# Altium schematic sheet 02_Power.SchDoc
size 513 x 386 mm
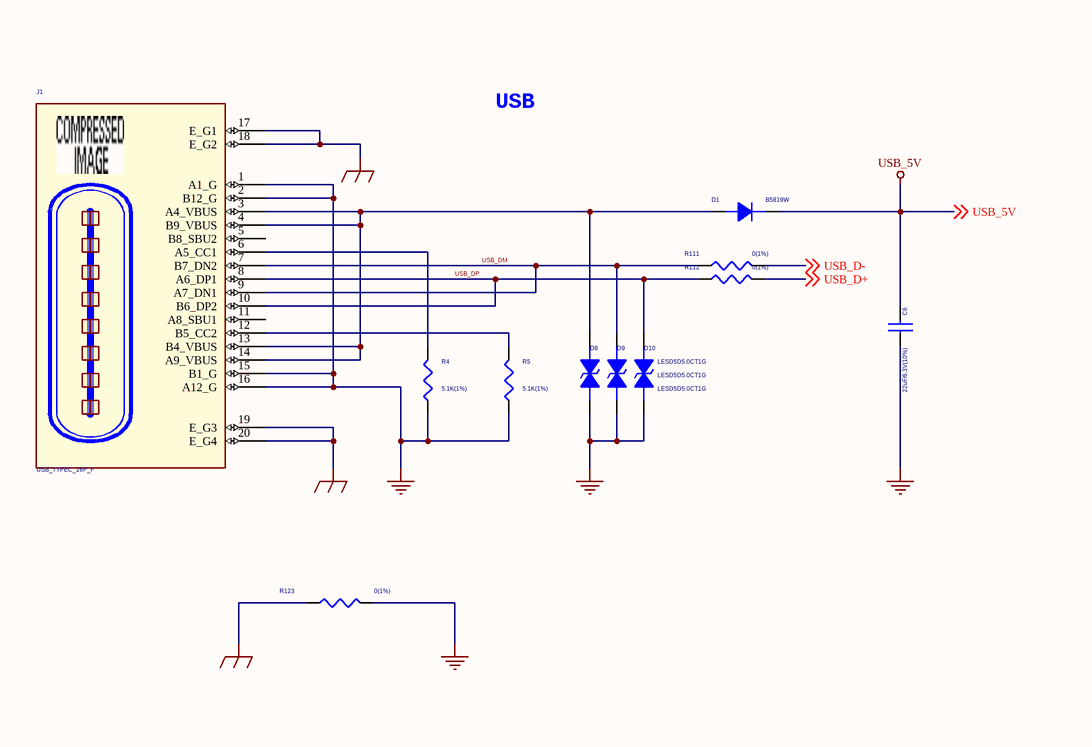
[diagram p0: 02_Power.SchDoc, left]
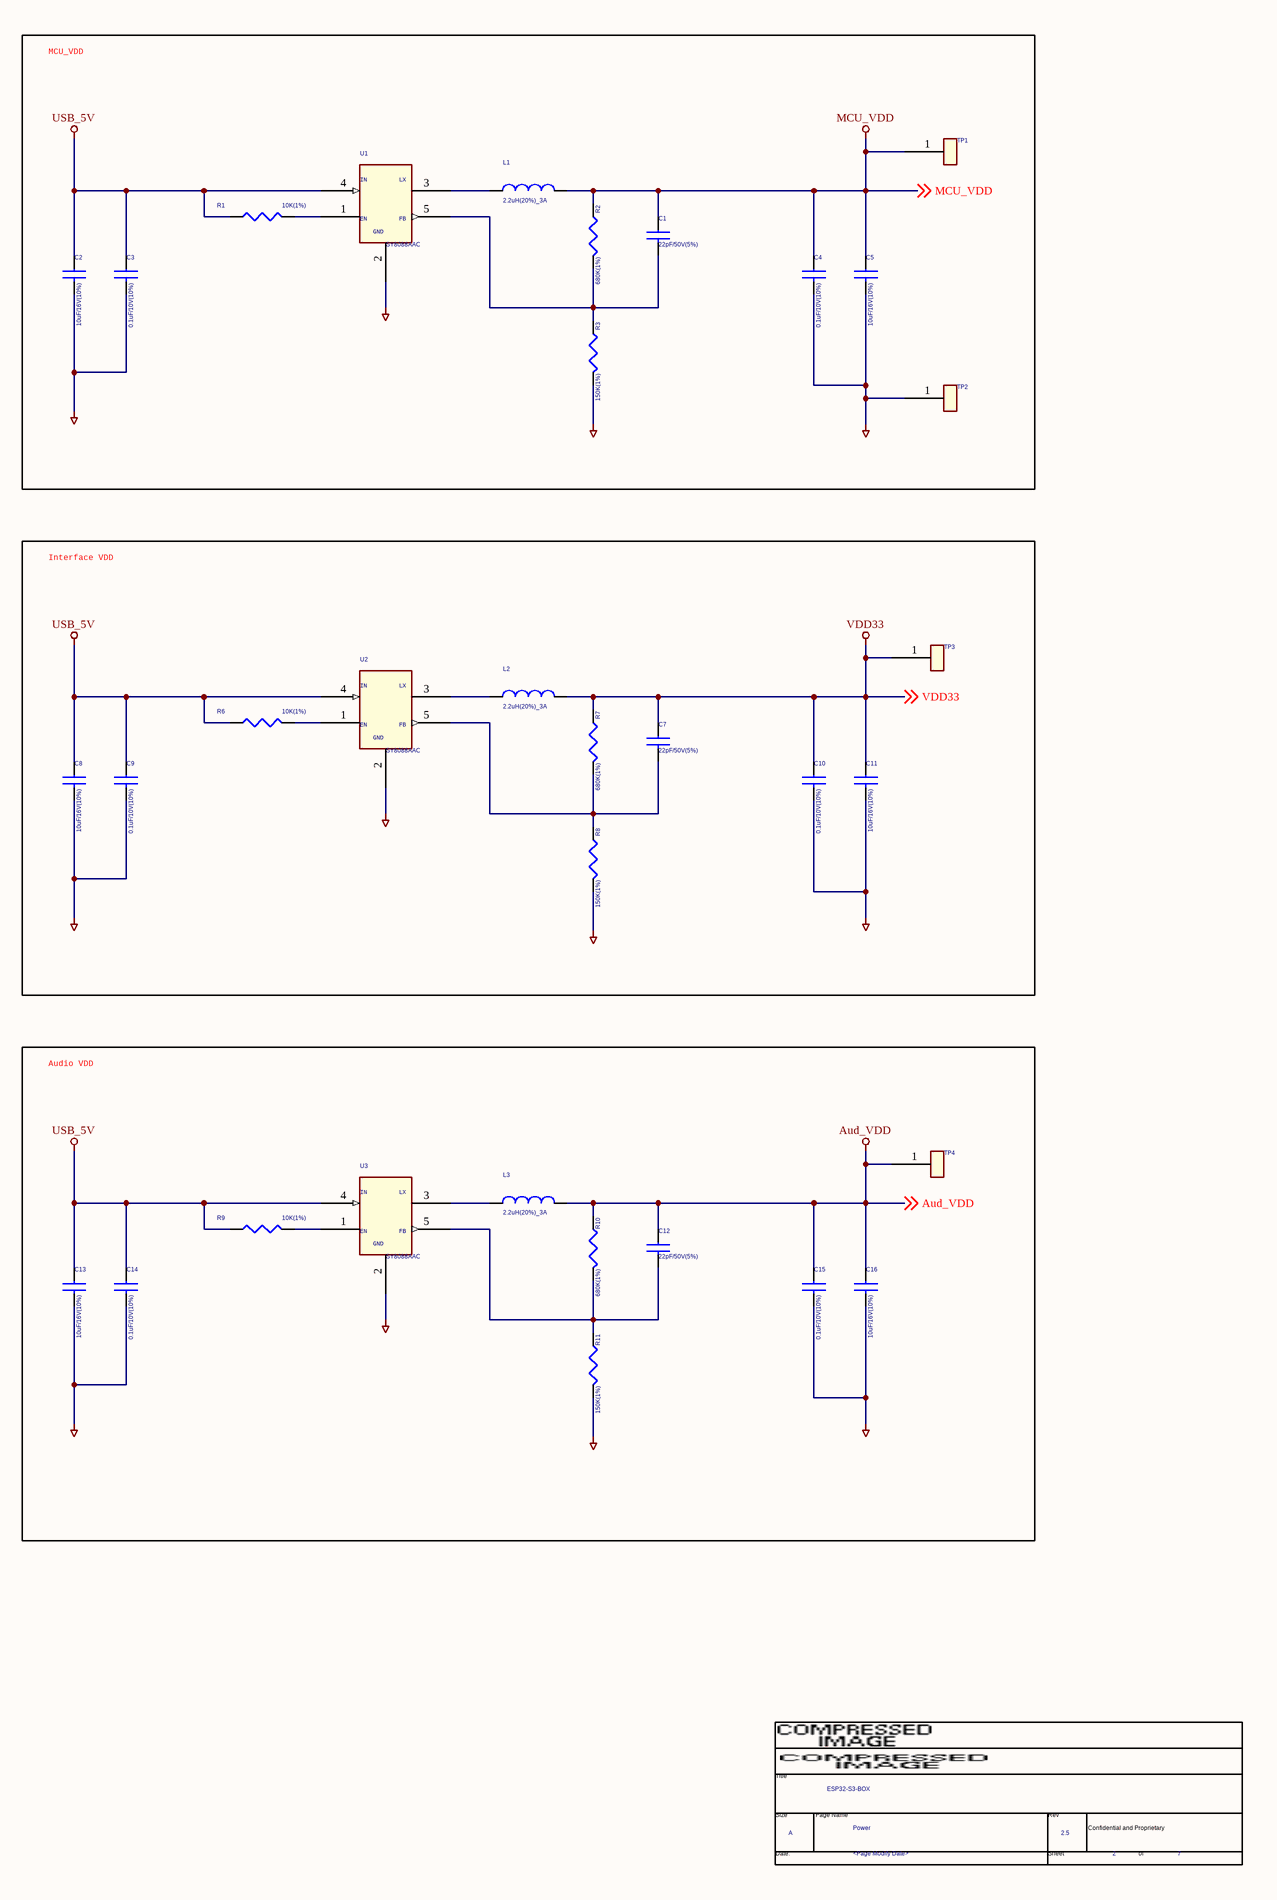
[diagram p1: 02_Power.SchDoc, right]

## Parts
*  Page Modify Date: <Page Modify Date>  Page Name: Power  Title: ESP32-S3-BOX  Page Size: A  Page Number: 2  Page Count: 7  RevCode: 2.5  (hidden comment: espTitleBlock3)  (graphical)
C1  22pF/50V(5%)  [C0402]
C2  10uF/16V(10%)  [C0603]
C3  0.1uF/10V(10%)  [C0402]
C4  0.1uF/10V(10%)  [C0402]
C5  10uF/16V(10%)  [C0603]
C6  22uF/6.3V(10%)  [C0603]
C7  22pF/50V(5%)  [C0402]
C8  10uF/16V(10%)  [C0603]
C9  0.1uF/10V(10%)  [C0402]
C10  0.1uF/10V(10%)  [C0402]
C11  10uF/16V(10%)  [C0603]
C12  22pF/50V(5%)  [C0402]
C13  10uF/16V(10%)  [C0603]
C14  0.1uF/10V(10%)  [C0402]
C15  0.1uF/10V(10%)  [C0402]
C16  10uF/16V(10%)  [C0603]
D1  B5819W  [SOD123]
D8  LESD5D5.0CT1G  [SOD523]
D9  LESD5D5.0CT1G  [SOD523]
D10  LESD5D5.0CT1G  [SOD523]
J1  USB_TYPEC_16P_F  [USB_TYPEC_16P_F]
L1  2.2uH(20%)_3A  [L4040_SL]
L2  2.2uH(20%)_3A  [L4040_SL]
L3  2.2uH(20%)_3A  [L4040_SL]
R1  10K(1%)  [R0402]
R2  680K(1%)  [R0402]
R3  150K(1%)  [R0402]
R4  5.1K(1%)  [R0201]
R5  5.1K(1%)  [R0201]
R6  10K(1%)  [R0402]
R7  680K(1%)  [R0402]
R8  150K(1%)  [R0402]
R9  10K(1%)  [R0402]
R10  680K(1%)  [R0402]
R11  150K(1%)  [R0402]
R111  0(1%)  [R0201]
R112  0(1%)  [R0201]
R123  0(1%)  [R0603]
TP1  TESTPOINT  [TPC_D40]  (value not drawn)
TP2  TESTPOINT  [TPC_D40]  (value not drawn)
TP3  TESTPOINT  [TPC_D40]  (value not drawn)
TP4  TESTPOINT  [TPC_D40]  (value not drawn)
U1  SY8088AAC  [SOT23-5]
U2  SY8088AAC  [SOT23-5]
U3  SY8088AAC  [SOT23-5]

## Blocks framed on the sheet
MCU_VDD: C1-C5 L1 R1-R3 TP1 TP2 U1
Interface VDD: C7-C11 L2 R6-R8 TP3 U2
Audio VDD: C12-C16 L3 R9-R11 TP4 U3

## Nets
Aud_VDD: C12.1 C15.1 C16.1 L3.2 R10.1 TP4.1 ; off-sheet Aud_VDD
GND: C2.2 C3.2 C4.2 C5.2 C6.1 C8.2 C9.2 C10.2 C11.2 C13.2 C14.2 C15.2 C16.2 D8.1 D9.1 D10.1 J1.1(A1_G) J1.2(B12_G) J1.15(B1_G) J1.16(A12_G) R3.2 R4.1 R5.1 R8.2 R11.2 R123.2 TP2.1 U1.2(GND) U2.2(GND) U3.2(GND)
GND_EARTH: J1.17(E_G1) J1.18(E_G2) J1.19(E_G3) J1.20(E_G4) R123.1
MCU_VDD: C1.1 C4.1 C5.1 L1.2 R2.1 TP1.1 ; off-sheet MCU_VDD
USB_5V: C2.1 C3.1 C6.2 C8.1 C9.1 C13.1 C14.1 D1.2(K) R1.1 R6.1 R9.1 U1.4(IN) U2.4(IN) U3.4(IN) ; off-sheet USB_5V
VDD33: C7.1 C10.1 C11.1 L2.2 R7.1 TP3.1 ; off-sheet VDD33
USB_D+: R112.2 ; off-sheet USB_D+
USB_D-: R111.2 ; off-sheet USB_D-
USB_DM: D9.2 J1.7(B7_DN2) J1.9(A7_DN1) R111.1
USB_DP: D10.2 J1.8(A6_DP1) J1.10(B6_DP2) R112.1
NetC1_2: C1.2 R2.2 R3.1 U1.5(FB)
NetC7_2: C7.2 R7.2 R8.1 U2.5(FB)
NetC12_2: C12.2 R10.2 R11.1 U3.5(FB)
NetD1_1: D1.1(A) D8.2 J1.3(A4_VBUS) J1.4(B9_VBUS) J1.13(B4_VBUS) J1.14(A9_VBUS)
NetJ1_6: J1.6(A5_CC1) R4.2
NetJ1_12: J1.12(B5_CC2) R5.2
NetL1_1: L1.1 U1.3(LX)
NetL2_1: L2.1 U2.3(LX)
NetL3_1: L3.1 U3.3(LX)
NetR1_2: R1.2 U1.1(EN)
NetR6_2: R6.2 U2.1(EN)
NetR9_2: R9.2 U3.1(EN)

Not connected (* = marked no-connect by the designer): J1 5(B8_SBU2) 11(A8_SBU1)

## Notes on the sheet
- USB
- (in symbol espTitleBlock3) Title; Size; Page Name; Rev; Confidential and Proprietary; Date:; Sheet; of

## Library data of the parts
* = espTitleBlock3: Doc: ESP32-S3-EYE_V1.0; OrgName: ESPRESSIF
C1 C7 C12 = CAPACITOR: Part Number: ES11041226520001; CODE12: ES11.04.122.6.5.2.00; Part Type: Capacitor
C2 C5 C8 C11 C13 C16 = CAPACITOR: Part Number: ES11067104600000; CODE12: ES11.06.710.4.6.0.00; Part Type: Capacitor
C3 C4 C9 C10 C14 C15 = CAPACITOR: Part Number: ES11045103620000; CODE12: ES11.04.510.3.6.2.00; Part Type: Capacitor
C6 = CAPACITOR: Part Number: ES11067222600001; CODE12: ES11.06.722.2.6.0.00; Part Type: Capacitor
D1 = DIODE_S: Part Number: ES31300150000000; CODE12: ES31.30.0020.00.0.0; Part Type: Diode
D8-D10 = DIODE_BI_DIR: Part Number: ES31320020000000; CODE12: ES31.32.0020.00.0.0; Part Type: Diode
J1 = USB_TYPEC_16P_F: Part Number: ES52220020000000; CODE12: ES52.22.0020.00.00; Part Type: Connector
L1-L3 = INDUCTOR_Dup1
R1 R6 R9 = RESISTOR: Part Number: ES21044100000001; CODE12: ES21.04.4100.0.00.0; Part Type: Resistor
R2 R7 R10 = RESISTOR: Part Number: ES21045680000001; CODE12: ES21.04.5680.0.00.0; Part Type: Resistor
R3 R8 R11 = RESISTOR: Part Number: ES21045150000001; CODE12: ES21.04.5150.0.00.0; Part Type: Resistor
R4 R5 = RESISTOR: Part Number: ES21023510000001; CODE12: ES21.02.3510.0.00.0; Part Type: Resistor
R111 R112 = RESISTOR: Part Number: ES21020000000001; CODE12: ES21.02.0000.0.00.0; Part Type: Resistor
R123 = RESISTOR: Part Number: ES21060000000001; CODE12: ES21.06.0000.0.00.0; Part Type: Resistor
U1-U3 = SY808X: Part Number: ES41140401000000; CODE12: ES41.14.04.01.00.00; Part Type: Power ICs